# Altium schematic sheet BoardB-FPGA3.SchDoc
size A; SheetNumber: 4; SheetTotal: 7
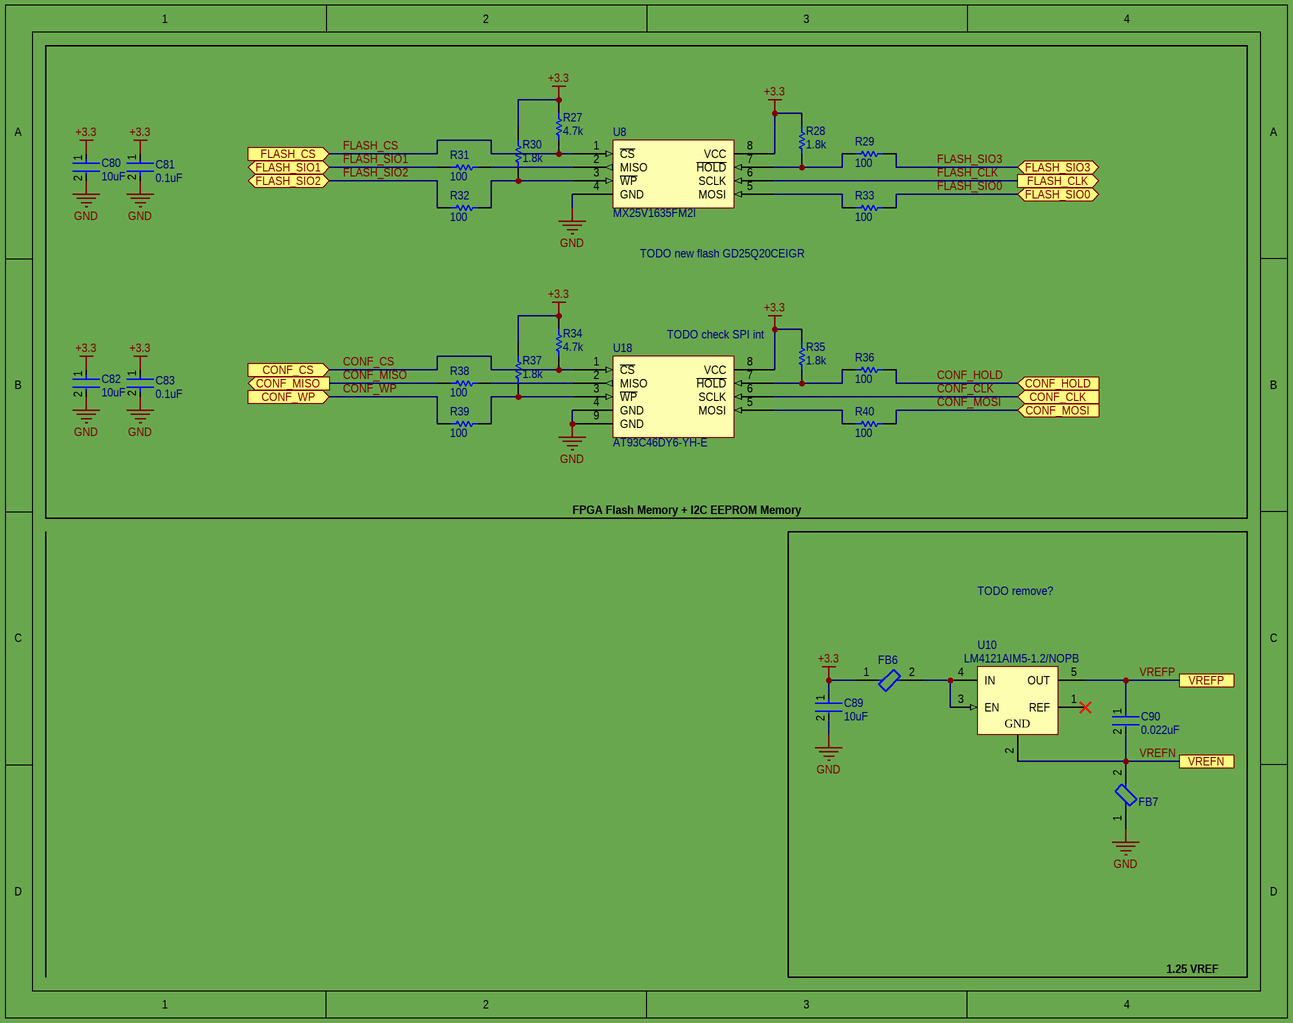
[diagram p0: BoardB-FPGA3.SchDoc]

## Parts
C80  10uF  [FP-CL05A106MP5NUNC-MFG]
C81  0.1uF  [FP-GRM15-MFG]
C82  10uF  [FP-CL05A106MP5NUNC-MFG]
C83  0.1uF  [FP-GRM15-MFG]
C89  10uF  [FP-GRM188-0_1-e0_2_0_55-IPC_C]
C90  0.022uF  [FP-CC0402-MFG]
FB6  BLM18AG601SN1D  [FP-BLM18-0_15-t0_8-MFG]  (value not drawn)
FB7  BLM18AG601SN1D  [FP-BLM18-0_15-t0_8-MFG]  (value not drawn)
R27  4.7k  [RESC1005X40X25NL05T05]
R28  1.8k  [RESC1005X40X25LL05T05]
R29  100  [RESC1005X40X25LL05T05]
R30  1.8k  [RESC1005X40X25LL05T05]
R31  100  [RESC1005X40X25LL05T05]
R32  100  [RESC1005X40X25LL05T05]
R33  100  [RESC1005X40X25LL05T05]
R34  4.7k  [RESC1005X40X25NL05T05]
R35  1.8k  [RESC1005X40X25LL05T05]
R36  100  [RESC1005X40X25LL05T05]
R37  1.8k  [RESC1005X40X25LL05T05]
R38  100  [RESC1005X40X25LL05T05]
R39  100  [RESC1005X40X25LL05T05]
R40  100  [RESC1005X40X25LL05T05]
U8  MX25V1635FM2I  [MX25V1635FM2I]
U10  LM4121AIM5-1.2/NOPB  [MF05A_M]
U18  AT93C46DY6-YH-E  [AT93C46DY6-YH-E]

## Ports
CONF_CLK (in), CONF_CS (in), CONF_HOLD (in), CONF_MISO (out), CONF_MOSI (in), CONF_WP (in), FLASH_CLK (out), FLASH_CS (in), FLASH_SIO0 (bidir), FLASH_SIO1 (bidir), FLASH_SIO2 (bidir), FLASH_SIO3 (bidir), VREFN, VREFP

## Nets
+3.3: C80.1 C81.1 C82.1 C83.1 C89.1 FB6.1 R27.2 R28.2 R30.2 R34.2 R35.2 R37.2 U8.8(VCC) U18.8(VCC)
GND: C80.2 C81.2 C82.2 C83.2 C89.2 FB7.1 U8.4(GND) U18.4(GND) U18.9(GND)
CONF_CLK: U18.6(SCLK) ; port CONF_CLK
CONF_CS: R34.1 U18.1(~{CS}) ; port CONF_CS
CONF_HOLD: R36.2 ; port CONF_HOLD
CONF_MISO: R38.1 ; port CONF_MISO
CONF_MOSI: R40.2 ; port CONF_MOSI
CONF_WP: R39.1 ; port CONF_WP
FLASH_CLK: U8.6(SCLK) ; port FLASH_CLK
FLASH_CS: R27.1 U8.1(~{CS}) ; port FLASH_CS
FLASH_SIO0: R33.2 ; port FLASH_SIO0
FLASH_SIO1: R31.1 ; port FLASH_SIO1
FLASH_SIO2: R32.1 ; port FLASH_SIO2
FLASH_SIO3: R29.2 ; port FLASH_SIO3
VREFN: C90.2 FB7.2 U10.2(GND) ; port VREFN
VREFP: C90.1 U10.5(OUT) ; port VREFP
NetFB6_2: FB6.2 U10.3(EN) U10.4(IN)
NetR28_1: R28.1 R29.1 U8.7(~{HOLD})
NetR30_1: R30.1 R32.2 U8.3(~{WP})
NetR31_2: R31.2 U8.2(MISO)
NetR33_1: R33.1 U8.5(MOSI)
NetR35_1: R35.1 R36.1 U18.7(~{HOLD})
NetR37_1: R37.1 R39.2 U18.3(~{WP})
NetR38_2: R38.2 U18.2(MISO)
NetR40_1: R40.1 U18.5(MOSI)

Not connected (* = marked no-connect by the designer): U10 1(REF)*

## Notes on the sheet
- TODO new flash GD25Q20CEIGR
- TODO check SPI int
- FPGA Flash Memory + I2C EEPROM Memory
- TODO remove?
- 1.25 VREF

## Library data of the parts
C80 C82 = CMP-13271-000002-1: CAP CER 10UF 10V X5R 0402; Manufacturer Part Number: CL05A106MP5NUNC; Manufacturer: Samsung; Temperature Coefficient: 15%; Tolerance: 20%; Material: Ceramic; Octopart: https://octopart.com/cl05a106mp5nunc-samsung-22457395; Voltage Rating: 10V; RoHS: TRUE; Value: 10uF; Height: 0.7mm; Digikey Description: CAP CER 10UF 10V X5R 0402; Automotive: No; Package: CL05A106MP5NUNC; Device Class L1: Passive Components; Capacitance: 10uF; Temperature Range High: +85°C; ComponentLink2Description: Datasheet; Device Class L2: Capacitors; Temperature Characteristic: X5R; Temperature: -55°C to +85°C; ComponentLink2URL: http://www.samsungsem.com/kr/support/product-search/mlcc/__icsFiles/afieldfile/2019/05/10/19-CL05A106MP5NUNC.pdf; Device Class L3: Ceramic Capacitors; Category: Cap; Temperature Range Low: -55°C; Ipc Land Pattern Name: CAPC10050X50; Lead Free: Yes
C81 C83 = CMP-2100-03641-2: CAP CER 0.1UF 16V X7R 0402; Manufacturer Part Number: GRM155R71C104KA88D; Manufacturer: Murata; Standoff Height: 0mm; Tolerance: 10%; Voltage Rating: 16Vdc; Material: Ceramic; Capacitance: 0.10μF; Value: 0.10μF; RoHS: TRUE; Temperature Characteristic: X7R; Octopart: https://octopart.com/grm155r71c104ka88d-murata-196880; Digikey Description: CAP CER 0.1UF 16V X7R 0402; Device Class L3: Ceramic Capacitors; Height: 0.55mm; ComponentLink2Description: Datasheet; Temperature Range Low: -55°C; Ipc Land Pattern Name: CAPC10050X219; ComponentLink2URL: https://search.murata.co.jp/Ceramy/image/img/A01X/G101/ENG/GRM155R71H471KA01-01A.pdf; Device Class L1: Passive Components; Lead Free: yes; Category: Cap; Package: GRM15; Temperature: -55°C to +125°C; Device Class L2: Capacitors; Temperature Range High: +125°C; Mouser Description: 0402 0.1 uF 16V ±10 % Tolerance X7R SMT Multilayer Ceramic Capacitor
C89 = CMP-2006-02792-2: Chip Multilayer Ceramic Capacitors for General Purpose, 0603, 10uF, X5R, 15%, 20%, 6.3V; Packaging: Tape and Reel; Voltage Rating (DC): 6.3V; Width: 0.031inch; Termination: SMD/SMT; Dielectric: X5R; Package Quantity: 4000; Voltage Rating: 6.3V; Capacitance: 10uF; Case/Package: 0603; Min Operating Temperature: -55°C; Voltage: 6.3V; Length: 1.6mm; Thickness: 0.035inch; Lead Free: Lead Free; Depth: 0.8mm; Case Code (Imperial): 0603; Max Operating Temperature: 85°C; Material: Ceramic; Height: 0.8mm; Tolerance: 20%; Mount: Surface Mount; REACH SVHC: No SVHC; Radiation Hardening: No; Case Code (Metric): 1608
C90 = CMP-03422-001279-1: CAP CER 0.022UF 16V X7R 0402; Manufacturer Part Number: CC0402KRX7R7BB223; Manufacturer: YAGEO; Temperature Coefficient: 30ppm/°C; Value: 22 nF; Automotive Grade: NA; Tolerance: 0.1; Material: Ceramic; RoHS: TRUE; Voltage Rating: 16 V; Mouser Description: Multilayer Ceramic Capacitors MLCC - SMD/SMT 22nF 16V X7R 10%; Package: CC0402; Height: 0.55mm; Octopart: https://octopart.com/cc0402krx7r7bb223-yageo-42244626; ComponentLink2URL: http://www.yageo.com/documents/recent/UPY-GP_NP0_16V-to-50V_16.pdf; Lead Free: Yes; Temperature Characteristic: X7R; Ipc Land Pattern Name: CAPC10050X50; Temperature Range High: +125°C; Device Class L3: Ceramic Capacitors; Device Class L2: Capacitors; Device Class L1: Passive Components; ComponentLink2Description: Datasheet; Capacitance: 22 nF; Automotive: No; Temperature Range Low: -55°C; Footprint Url: http://www.yageo.com/exep/pages/download/literatures/UPY-C_GEN_24.pdf; Category: Cap; Temperature: -55°C to +125°C; Digikey Description: CAP CER 0.022UF 16V X7R 0402
FB6 FB7 = CMP-0686-00436-3: Chip Ferrite Bead, 0603, 600Ω @ 100MHz, 0.38Ω, 25%, 500mA; Number of Lines: 1; Impedance: 600R; DC Resistance (DCR): 380mR; Material: Steel; Shielding: Unshielded; Max DC Current: 500mA; Termination: SMD/SMT; Military Standard: Not; Number of Circuits: 1; Min Operating Temperature: -55°C; Case Code (Imperial): 0603; Width: 0.8mm; Current Rating: 500mA; Lead Free: Lead Free; Packaging: Tape and Reel; Frequency: 100MHz; Max Operating Temperature: 125°C; DC Current: 500mA; REACH SVHC: No SVHC; Case/Package: 0603; Package Quantity: 1; Height: 0.8mm; Number of Pins: 2; Depth: 0.8mm; Test Frequency: 100MHz; Case Code (Metric): 1608; Tolerance: 25%; Core Material: Ferrite; Weight: 7.1E-05oz; Max Current Rating: 500mA; Radiation Hardening: No; Length: 1.6mm; RoHS Compliant: Yes
R27 R34 = CMP-2002-01154-4: Chip Resistor, 4.7 KOhm, +/- 1%, 0.1 W, -55 to 155 degC, 0402 (1005 Metric), RoHS, Tape and Reel; PartNumber: ERJ-2RKF4701X; Voltage Rating: 50 V; Case\/Package: 0402; Power Rating: 100 mW; Height: 0.35 mm; Mounting Technology: Surface Mount; REACH SVHC: Yes; Resistance: 4.7 KOhm; Max Operating Temperature: 155 degC; ComponentLink1Description: Manufacturer URL; ComponentLink2Description: Datasheet; Pins: 2; PackageReference: 0402; Tolerance: 1%; Case Code (Imperial): 0402; Length: 1 mm; PackageDescription: 2-Pin Surface Mount Device, Body 1 x 0.5 mm; RoHSCompliant: true; Package Quantity: 1; Radiation Hardening: No; DatasheetVersion: 04/2015; Width: 0.5 mm; Case Code (Metric): 1005; Mount: Surface Mount; ComponentLink1URL: http://www.panasonic.com/; Min Operating Temperature: -55 degC; Packaging: Cut Tape; ComponentLink2URL: http://industrial.panasonic.com/cdbs/www-data/pdf/RDA0000/AOA0000C86.pdf
R28 R30 R35 R37 = CMP-2002-01128-1: Manufacturer: Panasonic; Part Number: ERJ2RKF1801X
R29 R31-R33 R36 R38-R40 = CMP-2002-00605-3: Chip Resistor, 100 Ohm, +/- 1%, 100 mW, -55 to 155 degC, 0402 (1005 Metric), RoHS, Tape and Reel; Manufacturer: Basic Passives; PartNumber: ERJ-2RKF1000X; Power Rating: 100 mW; Resistance: 100 Ohm; Voltage Rating: 50 V; Case\/Package: 0402; Width: 0.5 mm; Pins: 2; ComponentLink2Description: Datasheet; PackageReference: 0402; Height: 0.35 mm; Tolerance: 1%; DatasheetVersion: 04/2015; Case Code (Imperial): 0402; Min Operating Temperature: -55 degC; Radiation Hardening: No; Length: 1 mm; Package Quantity: 10000; PackageDescription: 2-Pin Surface Mount Device, Body 1 x 0.5 mm; Mounting Technology: Surface Mount; Case Code (Metric): 1005; Packaging: Tape and Reel; ComponentLink1URL: http://www.panasonic.com/; RoHSCompliant: true; Max Operating Temperature: 155 degC; REACH SVHC: Yes; ComponentLink1Description: Manufacturer URL; ComponentLink2URL: http://industrial.panasonic.com/cdbs/www-data/pdf/RDA0000/AOA0000C86.pdf; Mount: Surface Mount
U8 = MX25V1635FM2I: IC FLASH 16M SPI 80MHZ 8SOP; Manufacturer: Macronix; Memory Type: FLASH,NOR; Interface: SPI,Serial; Supplier 1: Digi-Key; Manufacturer Part Number: MX25V1635FM2I; RoHS: Yes; Category: Memory; Stock 1: 14366; Pricing 1: 1=0.71000, 10=0.64700, 25=0.63880, 50=0.63480, 100=0.56770, 250=0.56288, 500=0.55456, 1000=0.53472, 5000=0.48704 (USD); Case/Package: SOIC; Min Operating Temperature: -40°C; Max Operating Temperature: 85°C; Packaging: Rail/Tube; Frequency: 80MHz; Lead Free: Lead Free; RoHS Compliant: Yes; ComponentLink1URL: http://ckassoc.com/oldsite/pdf/Macronix_Product_Line_Card_July_2017_General%20_070617.pdf?src-supplier=Digi-Key; ComponentLink1Description: http://ckassoc.com/oldsite/pdf/Macronix_Product_Line_Card_July_2017_General%20_070617.pdf?src-supplier=Digi-Key; Supplier Part Number 1: 1092-1189-ND
U10 = CMP-0074-00208-2: Precision Micropower Low Dropout Voltage Reference, 5-pin SOT-23, Pb-Free; Manufacturer: National Semiconductor; PackageTopMarking: R19A*XTT; CompType: Voltage Reference IC; PowerWise: Y; PackageVersion: revD, Aug-2008; ComponentLink1Description: LM4121 Datasheet; ComponentLink2Description: LM4121 Web Page; ComponentLink3Description: MF05A Package Page; PackageReference: MF05A; ComponentLink2URL: http://www.national.com/pf/LM/LM4121.html; PackageDescription: Molded SOT-23, .115 x .063 x .040 in Body, 5 Lead, .0375 in Pitch; DatasheetVersion: Apr-2000; ComponentLink3URL: http://www.national.com/packaging/folders/mf05a.html; ComponentLink1URL: http://www.national.com/ds/LM/LM4121.pdf; RevisionNote: Component URLs added; PinCount: 5; RoHS: Y
U18 = AT93C46DY6-YH-E: EEPROM Memory IC 1Kb (128 x 8, 64 x 16) SPI 8-UDFN (2x3); Manufacturer: Microchip; Manufacturer Part Number: AT25040B-MAHL-E; RoHS: Yes; Supplier 1: Digi-Key; Supplier Part Number 1: AT93C46DY6-YH-ECT-ND